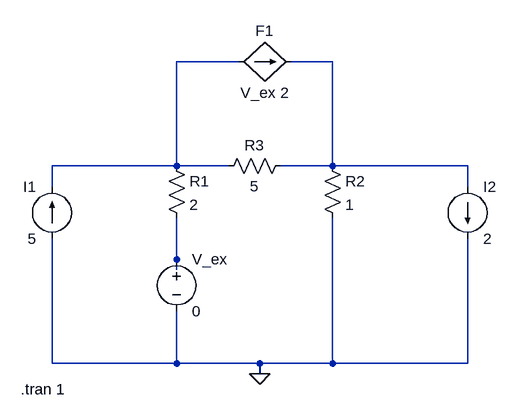
[diagram p0: schematic Ex_03_77.asc]
Ex_03_77.asc, the LTspice schematic file:
Version 4.1
SHEET 1 880 680
WIRE 256 -112 160 -112
WIRE 400 -112 336 -112
WIRE 160 48 160 -112
WIRE 160 48 -32 48
WIRE 240 48 160 48
WIRE 400 48 400 -112
WIRE 400 48 320 48
WIRE 608 48 400 48
WIRE -32 80 -32 48
WIRE 608 80 608 48
WIRE 160 192 160 128
WIRE 160 208 160 192
WIRE -32 352 -32 160
WIRE 160 352 160 272
WIRE 160 352 -32 352
WIRE 288 352 160 352
WIRE 400 352 400 128
WIRE 400 352 288 352
WIRE 608 352 608 160
WIRE 608 352 400 352
WIRE 288 368 288 352
FLAG 288 368 0
SYMBOL current -32 160 R180
WINDOW 0 24 80 Left 2
WINDOW 3 24 0 Left 2
WINDOW 123 0 0 Left 0
WINDOW 39 0 0 Left 0
SYMATTR InstName I1
SYMATTR Value 5
SYMBOL current 608 80 R0
WINDOW 123 0 0 Left 0
WINDOW 39 0 0 Left 0
SYMATTR InstName I2
SYMATTR Value 2
SYMBOL res 144 32 R0
SYMATTR InstName R1
SYMATTR Value 2
SYMBOL res 384 32 R0
SYMATTR InstName R2
SYMATTR Value 1
SYMBOL res 336 32 R90
WINDOW 0 0 56 VBottom 2
WINDOW 3 32 56 VTop 2
SYMATTR InstName R3
SYMATTR Value 5
SYMBOL voltage 160 176 R0
WINDOW 123 0 0 Left 0
WINDOW 39 0 0 Left 0
SYMATTR InstName V_ex
SYMATTR Value 0
SYMBOL f 256 -112 R270
WINDOW 0 32 40 VTop 2
WINDOW 3 -32 40 VBottom 2
SYMATTR InstName F1
SYMATTR Value V_ex 2
TEXT -80 392 Left 2 !.tran 1

The netlist it stands for:
* Ex_03_77.asc
I1 0 N001 5
I2 N002 0 2
R1 N001 N003 2
R2 N002 0 1
R3 N002 N001 5
V_ex N003 0 0
F1 N001 N002 V_ex 2
.tran 1
.backanno
.end